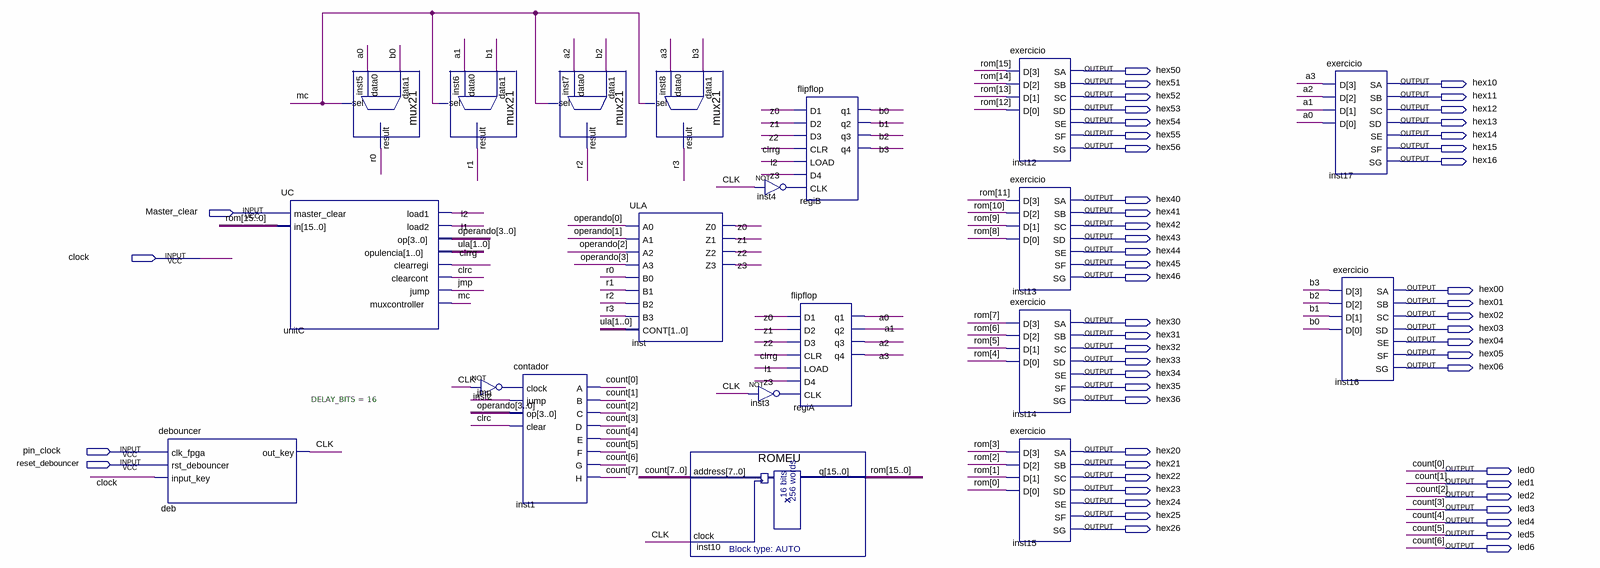
[diagram p0: schematic sheet]
// Quartus schematic cpu.bdf as structural Verilog: 20 symbols, 53 pins
module cpu (
  input  Master_clear,
  input  clock,
  input  pin_clock,
  input  reset_debouncer,
  output hex50,
  output hex51,
  output hex10,
  output hex52,
  output hex11,
  output hex53,
  output hex12,
  output hex54,
  output hex13,
  output hex55,
  output hex14,
  output hex56,
  output hex15,
  output hex16,
  output hex40,
  output hex41,
  output hex42,
  output hex43,
  output hex44,
  output hex45,
  output hex46,
  output hex00,
  output hex01,
  output hex02,
  output hex30,
  output hex03,
  output hex31,
  output hex04,
  output hex32,
  output hex05,
  output hex33,
  output hex06,
  output hex34,
  output hex35,
  output hex36,
  output hex20,
  output hex21,
  output led0,
  output hex22,
  output led1,
  output hex23,
  output led2,
  output hex24,
  output led3,
  output hex25,
  output led4,
  output hex26,
  output led5,
  output led6
);

  wire a0, a1, a2, a3, b0, b1, b2, b3, CLK, clrc, clrrg, inst2_out, inst3_out, inst4_out, jmp, l1, l2, mc,
       r0, r1, r2, r3, z0, z1, z2, z3;
  wire [1:0] ula;
  wire [3:0] operando;
  wire [7:7] count;
  wire [15:0] rom;

  debouncer #(.DELAY_BITS(16)) deb (
    .clk_fpga(pin_clock), .rst_debouncer(reset_debouncer), .input_key(clock), .out_key(CLK));
  UC unitC (
    .master_clear(Master_clear), .in(rom), .load1(l2), .load2(l1), .op(operando), .opulencia(ula),
    .clearregi(clrrg), .clearcont(clrc), .jump(jmp), .muxcontroller(mc));
  mux21 inst5 (.data1(b0), .data0(a0), .sel(mc), .result(r0));
  mux21 inst6 (.data1(b1), .data0(a1), .sel(mc), .result(r1));
  not inst2 (inst2_out, CLK);
  mux21 inst7 (.data1(b2), .data0(a2), .sel(mc), .result(r2));
  contador inst1 (
    .clock(inst2_out), .jump(jmp), .op(operando), .clear(clrc), .A(led0), .H(count[7]), .B(led1), .C(led2),
    .D(led3), .E(led4), .F(led5), .G(led6));
  mux21 inst8 (.data1(b3), .data0(a3), .sel(mc), .result(r3));
  ULA inst (
    .A0(operando[0]), .A1(operando[1]), .A2(operando[2]), .A3(operando[3]), .B0(r0), .B1(r1), .B2(r2),
    .B3(r3), .CONT(ula), .Z0(z0), .Z1(z1), .Z2(z2), .Z3(z3));
  ROMEU inst10 (.address({count[7], led6, led5, led4, led3, led2, led1, led0}), .clock(CLK), .q(rom));
  not inst4 (inst4_out, CLK);
  not inst3 (inst3_out, CLK);
  flipflop regiB (
    .D1(z0), .D2(z1), .D3(z2), .CLR(clrrg), .LOAD(l2), .D4(z3), .CLK(inst4_out), .q1(b0), .q2(b1), .q3(b2),
    .q4(b3));
  flipflop regiA (
    .D1(z0), .D2(z1), .D3(z2), .CLR(clrrg), .LOAD(l1), .D4(z3), .CLK(inst3_out), .q1(a0), .q2(a1), .q3(a2),
    .q4(a3));
  exercicio inst12 (.D(rom[15:12]), .SA(hex50), .SB(hex51), .SC(hex52), .SD(hex53), .SE(hex54), .SF(hex55), .SG(hex56));
  exercicio inst13 (.D(rom[11:8]), .SA(hex40), .SB(hex41), .SC(hex42), .SD(hex43), .SE(hex44), .SF(hex45), .SG(hex46));
  exercicio inst14 (.D(rom[7:4]), .SA(hex30), .SB(hex31), .SC(hex32), .SD(hex33), .SE(hex34), .SF(hex35), .SG(hex36));
  exercicio inst15 (.D(rom[3:0]), .SA(hex20), .SB(hex21), .SC(hex22), .SD(hex23), .SE(hex24), .SF(hex25), .SG(hex26));
  exercicio inst17 (
    .D({a3, a2, a1, a0}), .SA(hex10), .SB(hex11), .SC(hex12), .SD(hex13), .SE(hex14), .SF(hex15), .SG(hex16));
  exercicio inst16 (
    .D({b3, b2, b1, b0}), .SA(hex00), .SB(hex01), .SC(hex02), .SD(hex03), .SE(hex04), .SF(hex05), .SG(hex06));

  // Other names for the same wires on the sheet: count[6:0] = {led6, led5, led4, led3, led2, led1, led0}
endmodule
